# EAGLE design vusb-i2c-tht (EAGLE 6.6.0)
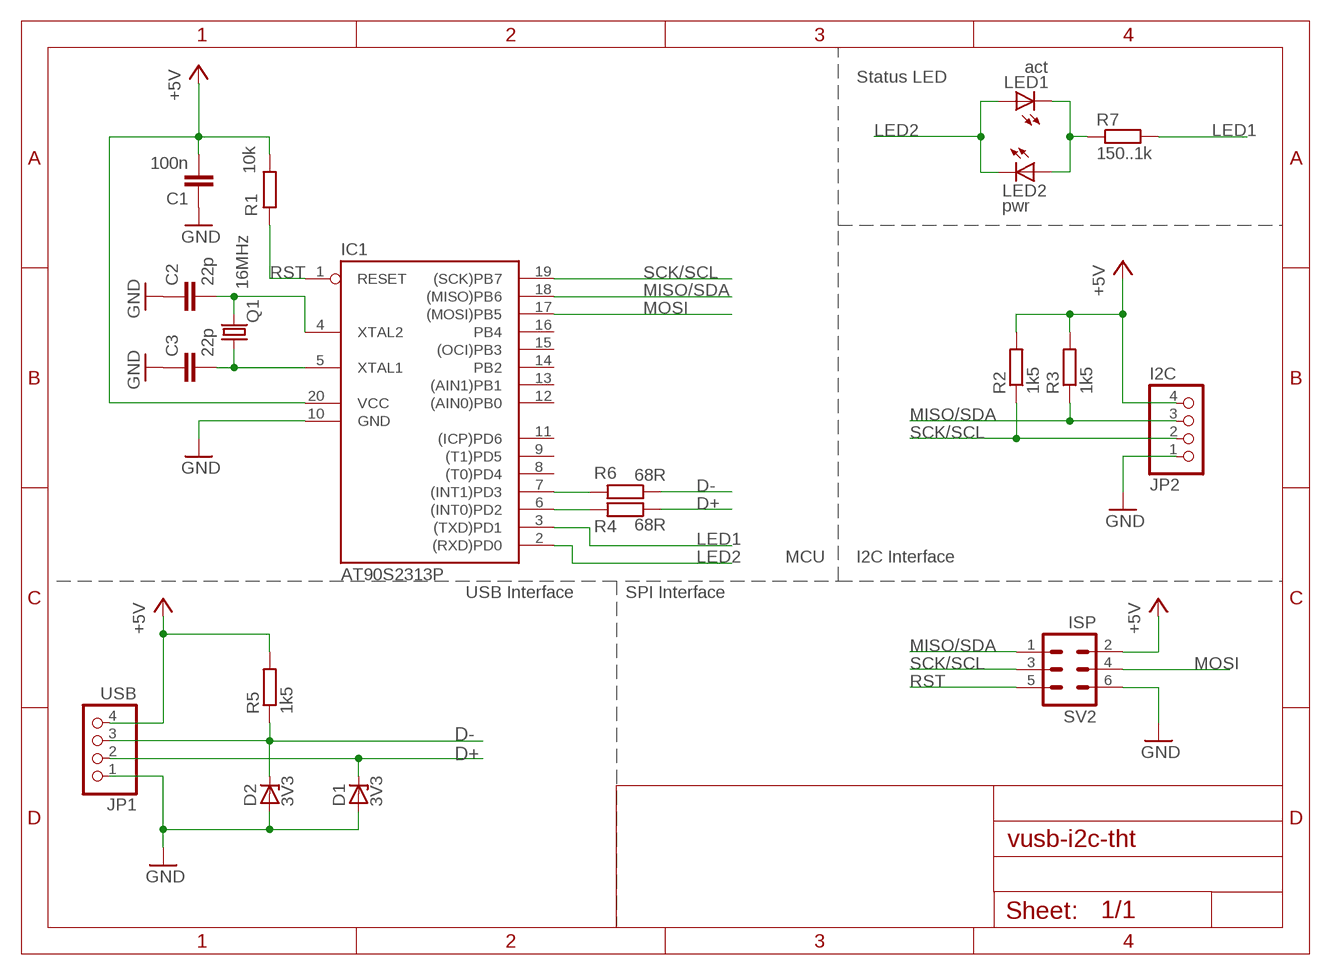
[diagram p0: schematic, sheet 1]

## Parts
C1  100n  C-EUC0805  [C0805]
C2  22p  C-EUC0805  [C0805]
C3  22p  C-EUC0805  [C0805]
D1  3V3  ZENER-DIODEDO34-7  [DO34Z7]
D2  3V3  ZENER-DIODEDO34-7  [DO34Z7]
IC1  AT90S2313P  [DIL20]
JP1  USB  PINHD-1X4  [1X04]
JP2  I2C  PINHD-1X4  [1X04]
LED1  act  LED3MM  [LED3MM]
LED2  pwr  LED3MM  [LED3MM]
Q1  16MHz  CRYTALHC49S  [HC49/S]
R1  10k  R-EU_0207/10  [0207/10]
R2  1k5  R-EU_0207/10  [0207/10]
R3  1k5  R-EU_0207/10  [0207/10]
R4  68R  R-EU_0207/10  [0207/10]
R5  1k5  R-EU_0207/10  [0207/10]
R6  68R  R-EU_0207/10  [0207/10]
R7  150..1k  R-EU_0207/10  [0207/10]
SV2  ISP  ML6  [ML6]

## Nets
+5V: C1.2 IC1.20(VCC) JP1.4 JP2.4 R1.2 R2.2 R3.2 R5.2 SV2.2
AVRD+: IC1.6((INT0)PD2) R4.2
AVRD-: IC1.7((INT1)PD3) R6.2
D+: D1.C JP1.2 R4.1
D-: D2.C JP1.3 R5.1 R6.1
EAE: LED1.K(C) LED2.A R7.1
GND: C1.1 C2.1 C3.1 D1.A D2.A IC1.10(GND) JP1.1 JP2.1 SV2.6
LED1: IC1.3((TXD)PD1) R7.2
LED2: IC1.2((RXD)PD0) LED1.A LED2.K(C)
MISO/SDA: IC1.18((MISO)PB6) JP2.3 R3.1 SV2.1
MOSI: IC1.17((MOSI)PB5) SV2.4
N$37: C3.2 IC1.5(XTAL1) Q1.1
N$38: C2.2 IC1.4(XTAL2) Q1.2
RST: IC1.1(RESET) R1.1 SV2.5
SCK/SCL: IC1.19((SCK)PB7) JP2.2 R2.1 SV2.3
Unconnected: IC1.8((T0)PD4) IC1.9((T1)PD5) IC1.11((ICP)PD6) IC1.12((AIN0)PB0) IC1.13((AIN1)PB1) IC1.14(PB2) IC1.15((OCI)PB3) IC1.16(PB4)

## Notes on the sheet
- Status LED
- MCU | I2C Interface
- USB Interface | SPI Interface

## Library data of the parts
C1-C3 = rcl:C-EU: CAPACITOR, European symbol
D1 D2 = diode:ZENER-DIODE: Z-Diode
IC1 = atmel:AT90S2313: MICROCONTROLLER 2 Kbytes FLASH 128 bytes SRAM 128 bytes EEPROM UART
JP1 JP2 = pinhead:PINHD-1X4: PIN HEADER
LED1 LED2 = led:LED: LED OSRAM: - CHIPLED LG R971, LG N971, LY N971, LG Q971, LY Q971, LO R971, LY R971 LH N974, LH R974 LS Q976, LO Q976, LY Q976 LO Q996 - Hyper CHIPLED LW Q18S LB Q993, LB Q99A, LB R99A - SideLED LS A670, LO A670, LY A670, LG A670, LP A670 LB A673, LV A673, LT A673, LW A673 LH A674 LY A675 LS A676, LA A676, LO A676, LY A676, LW A676 LS A679, LY A679, LG A679 - Hyper Micro SIDELED® LS Y876, LA Y876, LO Y876, LY Y876 LT Y87S - SmartLED LW L88C, LW L88S LB L89C, LB L89S, LG L890 LS L89K, LO L89K, LY L89K LS L896, LA L896, LO L896, LY L896 - TOPLED LS T670, LO T670, LY T670, LG T670, LP T670 LSG T670, LSP T670, LSY T670, LOP T670, LYG T670 LG T671, LOG T671, LSG T671 LB T673, LV T673, LT T673, LW T673 LH T674 LS T676, LA T676, LO T676, LY T676, LB T676, LH T676, LSB T676, LW T676 LB T67C, LV T67C, LT T67C, LS T67K, LO T67K, LY T67K, LW E67C LS E67B, LA E67B, LO E67B, LY E67B, LB E67C, LV E67C, LT E67C LW T67C LS T679, LY T679, LG T679 LS T770, LO T770, LY T770, LG T770, LP T770 LB T773, LV T773, LT T773, LW T773 LH T774 LS E675, LA E675, LY E675, LS T675 LS T776, LA T776, LO T776, LY T776, LB T776 LHGB T686 LT T68C, LB T68C - Hyper Mini TOPLED® LB M676 - Mini TOPLED Santana® LG M470 LS M47K, LO M47K, LY M47K Source: http://www.osram.convergy.de LUXEON: - LUMILED® LXK2-PW12-R00, LXK2-PW12-S00, LXK2-PW14-U00, LXK2-PW14-V00 LXK2-PM12-R00, LXK2-PM12-S00, LXK2-PM14-U00 LXK2-PE12-Q00, LXK2-PE12-R00, LXK2-PE12-S00, LXK2-PE14-T00, LXK2-PE14-U00 LXK2-PB12-K00, LXK2-PB12-L00, LXK2-PB12-M00, LXK2-PB14-N00, LXK2-PB14-P00, LXK2-PB14-Q00 LXK2-PR12-L00, LXK2-PR12-M00, LXK2-PR14-Q00, LXK2-PR14-R00 LXK2-PD12-Q00, LXK2-PD12-R00, LXK2-PD12-S00 LXK2-PH12-R00, LXK2-PH12-S00 LXK2-PL12-P00, LXK2-PL12-Q00, LXK2-PL12-R00 Source: www.luxeon.com KINGBRIGHT: KA-3528ASYC Source: www.kingbright.com
Q1 = crystal:CRYTAL: CRYSTAL
R1-R7 = rcl:R-EU_: RESISTOR, European symbol
SV2 = con-harting-ml:ML6: HARTING; OC_FARNELL: unknown; OC_NEWARK: unknown

## Board
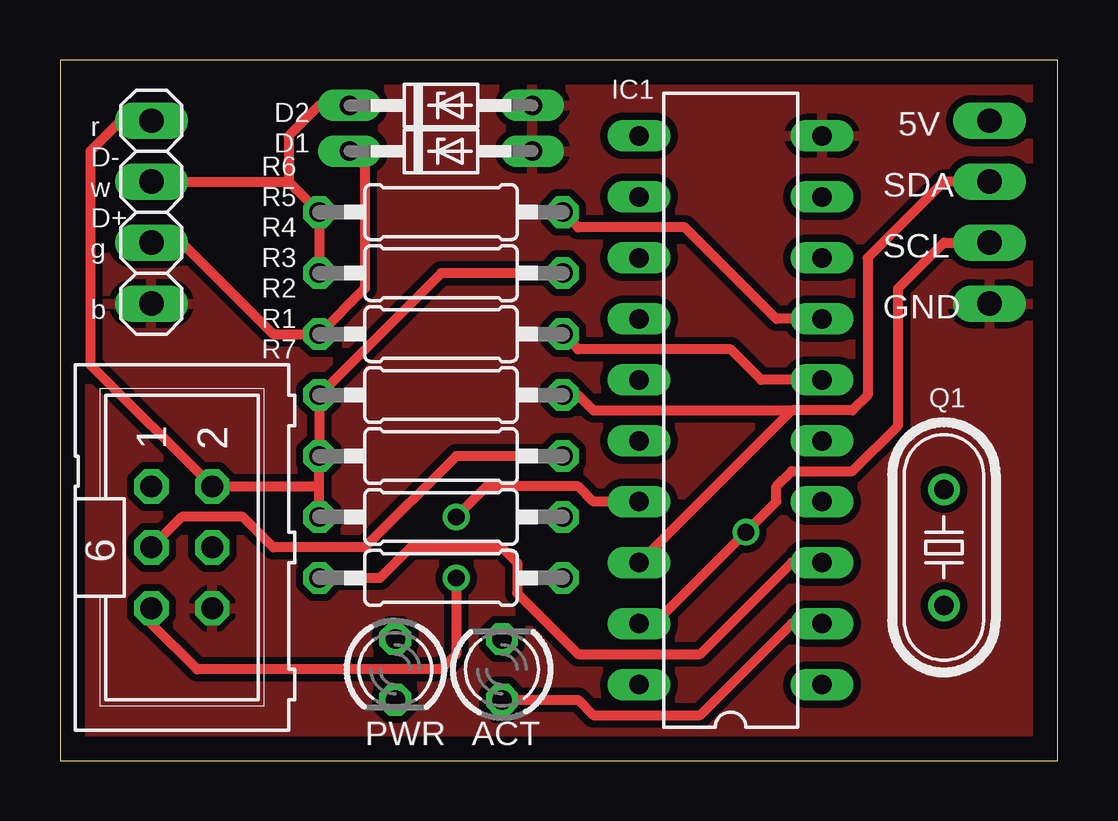
[diagram p1: board, top side]
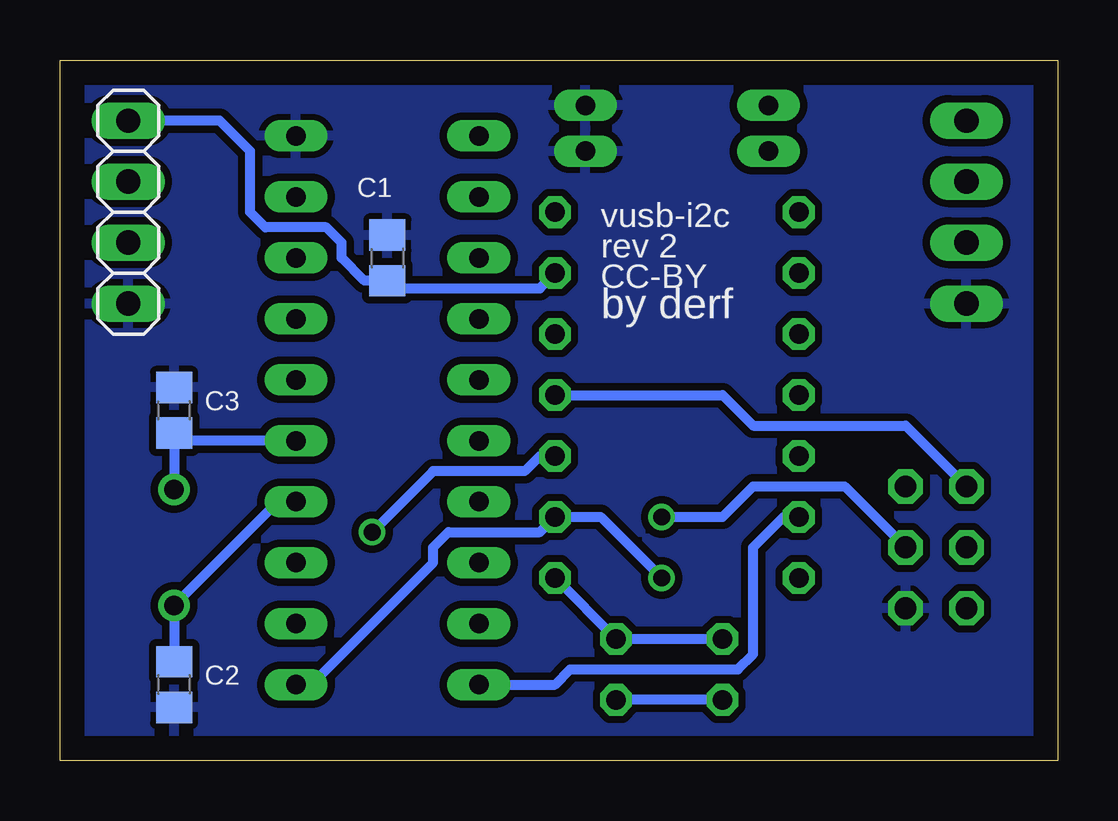
[diagram p2: board, bottom side, seen from below]

Size 41.58 x 29.2 mm. Coordinates in mm from the lower left corner, seen from the top.
Outline: 0,0 41.58,0 41.58,29.2 0,29.2 0,0
Copper layers (1*16): Top 0.035mm / dielectric 1.5mm / Bottom 0.035mm
Design rules "default *": minimum track width 10mil, minimum drill 24mil, track to track 8mil, track to pad 8mil, pad to pad 8mil, via to via 8mil, smd to smd 8mil, copper to edge 40mil, drill to drill 8mil, minimum pad ring 10mil, minimum via ring 8mil, stop-mask expansion 4mil, vias tented up to drill 0mil, thermal gap 10mil

### Footprints (pad centres in the part's own frame; a part is rotated, then mirrored left to right if it is on the bottom)
C0805 = smd 1.3 x 1.5: 1 -0.95,0; 2 0.95,0
DO34Z7 = drill 0.813 long: A 3.81,0; C -3.81,0
DIL20 = drill 0.813 long: 1 -11.43,-3.81; 2 -8.89,-3.81; 3 -6.35,-3.81; 4 -3.81,-3.81; 5 -1.27,-3.81; 6 1.27,-3.81; 7 3.81,-3.81; 8 6.35,-3.81; 9 8.89,-3.81; 10 11.43,-3.81; 11 11.43,3.81; 12 8.89,3.81; 13 6.35,3.81; 14 3.81,3.81; 15 1.27,3.81; 16 -1.27,3.81; 17 -3.81,3.81; 18 -6.35,3.81; 19 -8.89,3.81; 20 -11.43,3.81
1X04 = drill 1.016 long: 1 -3.81,0; 2 -1.27,0; 3 1.27,0; 4 3.81,0
LED3MM = drill 0.813 octagon: A -1.27,0; K 1.27,0
HC49/S = drill 0.813: 1 -2.413,0; 2 2.413,0
0207/10 = drill 0.813 octagon: 1 -5.08,0; 2 5.08,0
ML6 = drill 0.914 octagon: 1 -2.54,-1.27; 2 -2.54,1.27; 3 0,-1.27; 4 0,1.27; 5 2.54,-1.27; 6 2.54,1.27

### Placement (x,y rotation side)
C1  27.94,20.95 270 bottom
C2  36.83,3.17 90 bottom
C3  36.83,14.61 270 bottom
D1  15.88,25.4 0 top
D2  15.88,27.3 0 top
IC1  27.94,14.61 90 top
JP1  3.81,22.86 90 top
JP2  38.73,22.86 90 bottom
LED1  18.41,3.81 90 top
LED2  13.97,3.81 270 top
Q1  36.83,8.89 270 top
R1  15.88,10.16 180 top
R2  15.88,12.7 180 top
R3  15.88,15.24 180 top
R4  15.88,17.78 0 top
R5  15.88,20.32 0 top
R6  15.88,22.86 0 top
R7  15.88,7.62 180 top
SV2  5.08,8.89 270 top

### Tracks (layer width: path | path; a pad name or v marks a point on that pad's centre or on a via)
+5V
  Top 0.406: JP1.4 2.54,26.67 1.27,25.4 1.27,16.51 SV2.2 10.79,11.43 | R1.2 10.79,11.43 | 10.79,11.43 R2.2 R3.2 15.88,20.32 R5.2
  Bottom 0.406: JP2.4 34.92,26.67 33.66,25.4 33.66,22.86 33.02,22.23 30.48,22.23 29.84,21.59 29.84,20.95 28.89,20 C1.2 27.62,19.68 21.59,19.68 R5.2 | IC1.20 20.95,3.17 20.32,3.81 13.34,3.81 12.7,4.45 12.7,8.89 11.43,10.16 R1.2
AVRD+
  Top 0.406: IC1.6 29.21,15.88 27.94,17.14 21.59,17.14 R4.2
AVRD-
  Top 0.406: IC1.7 29.84,18.41 26.04,22.23 21.59,22.23 R6.2
D+
  Top 0.406: D1.C 12.7,24.77 12.7,19.68 R4.1 8.89,17.78 5.08,21.59 JP1.2
D-
  Top 0.406: R5.1 R6.1 9.84,23.81 9.53,24.13 | D2.C 10.79,27.3 9.53,26.04 9.53,24.13 | JP1.3 9.53,24.13
EAE
  Bottom 0.406: R7.1 LED1.K LED2.A
GND
  pour Top (isolate 0.305): 0,29.21 41.91,29.21 41.91,0 0,0
  pour Bottom (isolate 0.305): 0,29.21 41.91,29.21 41.91,0 0,0
LED1
  Top 0.406: IC1.3 30.48,8.26 26.67,4.45 21.59,4.45 19.05,6.99 19.05,8.26 18.41,8.89 14.61,8.89 13.34,7.62 R7.2
LED2
  Top 0.406: LED1.A 21.59,2.54 22.23,1.91 26.67,1.91 30.48,5.71 IC1.2
  Bottom 0.406: LED2.K LED1.A
MISO/SDA
  Top 0.406: JP2.3 36.83,24.13 33.66,20.95 33.66,15.24 33.02,14.61 30.48,14.61 | 30.48,14.61 IC1.18 | R3.1 21.59,15.24 22.23,14.61 30.48,14.61
  Bottom 0.406: R3.1 13.97,15.24 12.7,13.97 6.35,13.97 SV2.1
MOSI  (via drill 0.7)
  Top 0.406: IC1.17 22.23,10.79 21.59,11.43 17.78,11.43 v16.51,10.16
  Bottom 0.406: v16.51,10.16 13.97,10.16 12.7,11.43 8.89,11.43 SV2.4
N$37
  Bottom 0.406: IC1.5 36.51,13.34 C3.2 Q1.1
N$38
  Bottom 0.406: IC1.4 32.51,10.79 Q1.2 C2.2
RST  (via drill 0.7)
  Top 0.406: v16.51,7.62 16.51,4.45 15.88,3.81 5.71,3.81 3.81,5.71 SV2.5
  Bottom 0.406: IC1.1 31.11,3.17 26.04,8.26 26.04,8.89 25.4,9.53 21.59,9.53 R1.1 19.05,10.16 v16.51,7.62
SCK/SCL  (via drill 0.7)
  Top 0.406: IC1.19 24.77,5.71 v28.57,9.53 29.84,10.79 29.84,11.43 30.48,12.06 33.02,12.06 34.92,13.97 34.92,19.68 36.83,21.59 JP2.2 | R2.1 16.51,12.7 12.7,8.89 8.89,8.89 7.62,10.16 5.08,10.16 SV2.3
  Bottom 0.406: R2.1 21.59,12.7 22.23,12.06 26.04,12.06 v28.57,9.53

### Text on the board
tNames: r | 5V | D- | w | SDA | D+ | g | SCL | b | GND | PWR | ACT
bNames: vusb-i2c | rev 2 | CC-BY | by derf